# Altium schematic sheet Sliders.SchDoc
size A4; SheetNumber: 4; SheetTotal: 4
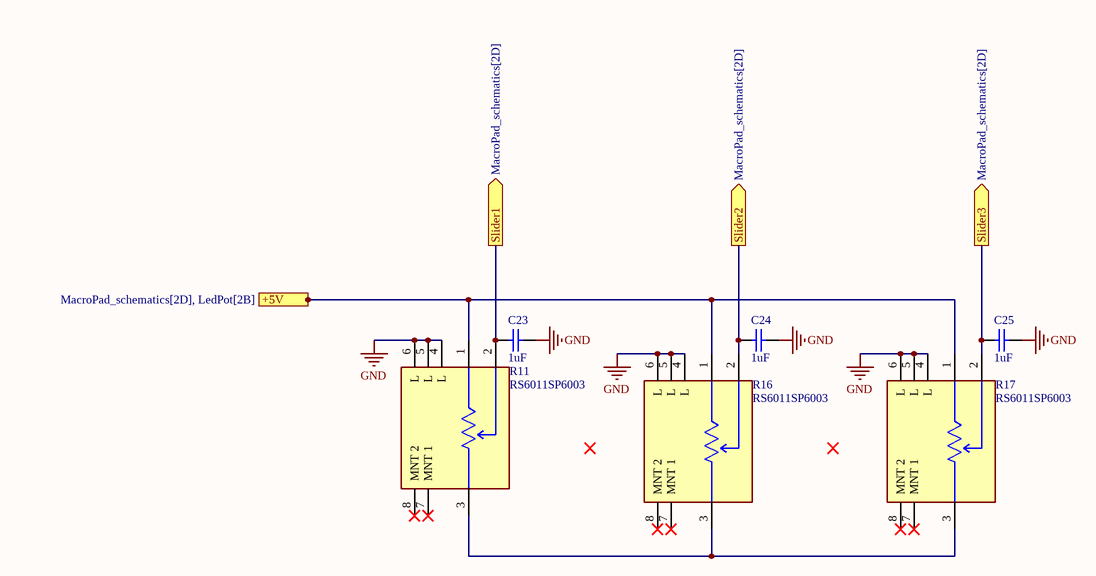
[diagram p0: Sliders.SchDoc]

## Parts
C23  value 1uF  [KEMT-1206-2_L]  (hidden comment: 1206 Capacitor)
C24  value 1uF  [KEMT-1206-2_L]  (hidden comment: 1206 Capacitor)
C25  value 1uF  [KEMT-1206-2_L]  (hidden comment: 1206 Capacitor)
R11  RS6011SP6003  [FP-RS6011SP6003-MFG]
R16  RS6011SP6003  [FP-RS6011SP6003-MFG]
R17  RS6011SP6003  [FP-RS6011SP6003-MFG]

## Ports
+5V (in, see MacroPad_schematics[2D], LedPot[2B]), Slider1 (out, see MacroPad_schematics[2D]), Slider2 (out, see MacroPad_schematics[2D]), Slider3 (out, see MacroPad_schematics[2D])

## Nets
GND: C23.1 C24.1 C25.1 R11.4(L) R11.5(L) R11.6(L) R16.4(L) R16.5(L) R16.6(L) R17.4(L) R17.5(L) R17.6(L)
+5V: R11.1 R16.1 R17.1 ; port +5V
Slider1: C23.2 R11.2 ; port Slider1
Slider2: C24.2 R16.2 ; port Slider2
Slider3: C25.2 R17.2 ; port Slider3
NetR11_3: R11.3 R16.3 R17.3

Not connected (* = marked no-connect by the designer): R11 7(MNT_1)* 8(MNT_2)*; R16 7(MNT_1)* 8(MNT_2)*; R17 7(MNT_1)* 8(MNT_2)*

## Library data of the parts
C23-C25 = CMP-001-00000-5: General Purpose Capacitor; Tolerance: 10%; Capacitor Type: Ceramic; Voltage Rating: 50V; Max Operating Temperature: 125°C; RoHS Compliant: Yes; Min Operating Temperature: -55°C; Case/Package: 1206
R11 R16 R17 = CMP-24118-000008-1: Slide Potentiometers Single Unit, 60mm Vertical Type; Resistance: 10kR; Tolerance: 20%; Voltage Rating: 150V; Min Operating Temperature: -10°C; Mount: Through Hole; Type: Potentiometer; Taper: Linear; Termination: Solder; Package Quantity: 90; Max Operating Temperature: 60°C; RoHS Compliant: Yes; Packaging: Tray; Series: RS6011xP